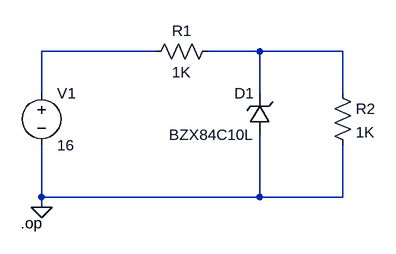
[diagram p0: schematic Draft9.asc]
Draft9.asc, the LTspice schematic file:
Version 4.1
SHEET 1 880 680
WIRE 112 64 -64 64
WIRE 272 64 192 64
WIRE 400 64 272 64
WIRE -64 128 -64 64
WIRE 272 128 272 64
WIRE 400 128 400 64
WIRE -64 288 -64 208
WIRE 272 288 272 192
WIRE 272 288 -64 288
WIRE 400 288 400 208
WIRE 400 288 272 288
WIRE -64 304 -64 288
FLAG -64 304 0
DATAFLAG 272 64 ""
DATAFLAG -64 64 ""
SYMBOL voltage -64 112 R0
SYMATTR InstName V1
SYMATTR Value 16
SYMBOL res 208 48 R90
WINDOW 0 0 56 VBottom 2
WINDOW 3 32 56 VTop 2
SYMATTR InstName R1
SYMATTR Value 1K
SYMBOL zener 288 192 R180
WINDOW 0 24 64 Left 2
WINDOW 3 24 0 Left 2
SYMATTR InstName D1
SYMATTR Value BZX84C10L
SYMBOL res 384 112 R0
SYMATTR InstName R2
SYMATTR Value 1K
TEXT -96 328 Left 2 !.op

The netlist it stands for:
* Draft9.asc
V1 N001 0 16
R1 N002 N001 1K
D1 0 N002 BZX84C10L
R2 N002 0 1K
.model D D
.lib standard.dio
.op
.backanno
.end